# Altium project PCB_Luciernagas.PrjPcb
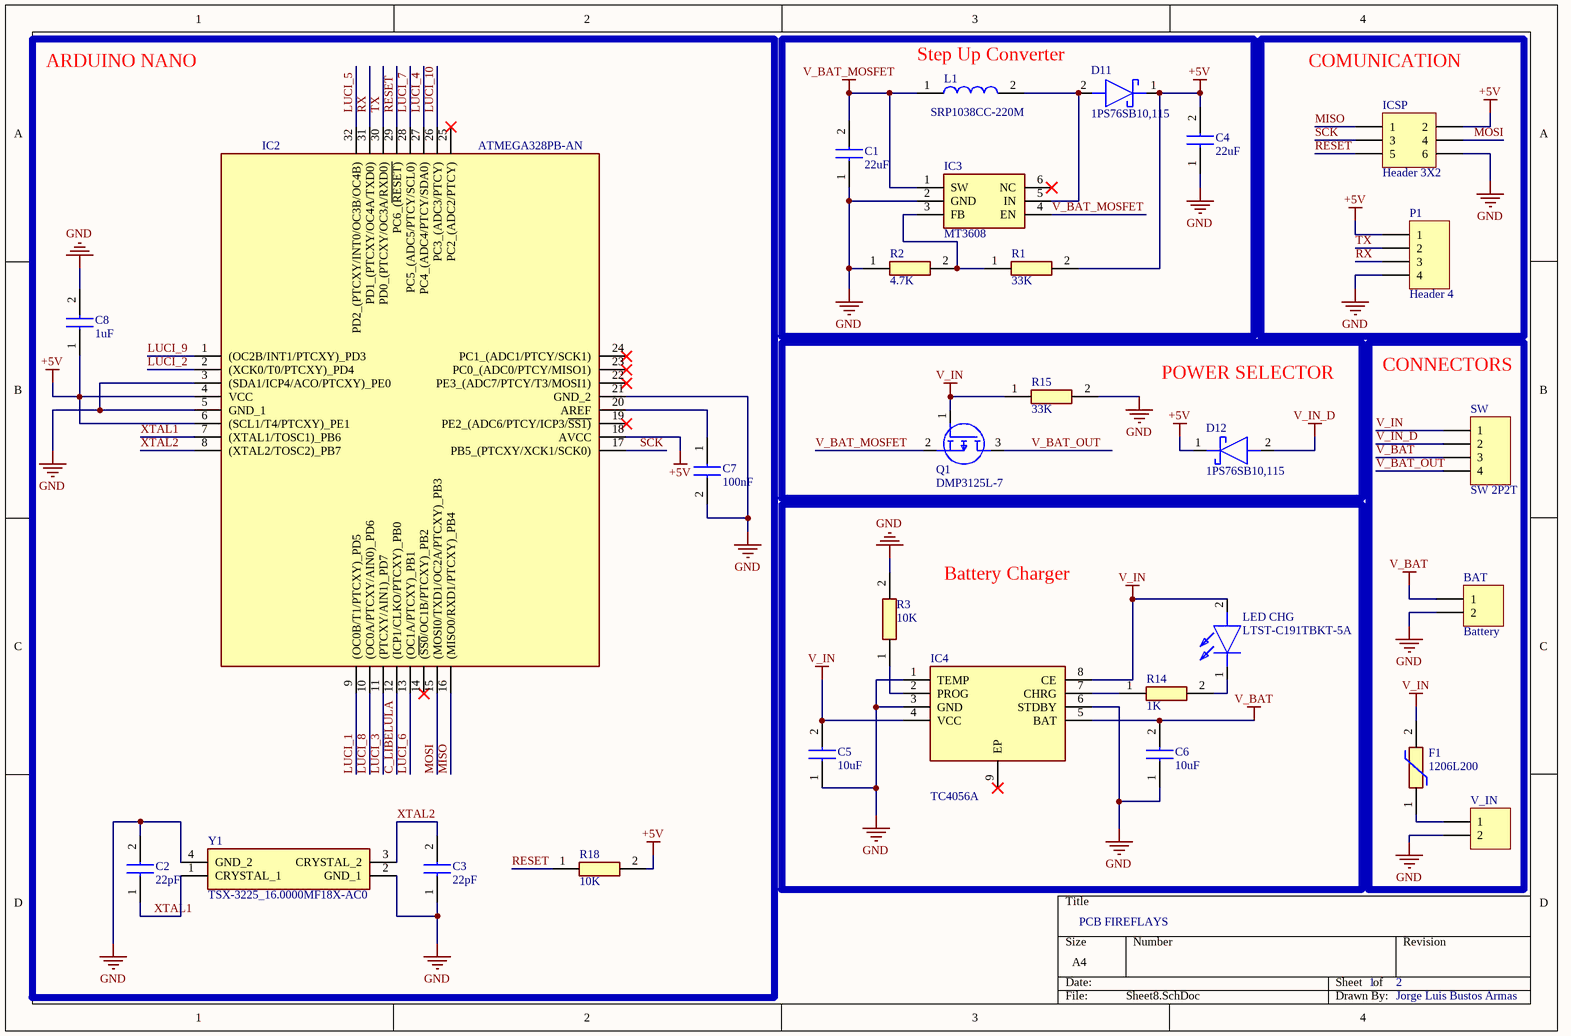
[diagram p0: Sheet8.SchDoc]
2 sheets, 56 parts. Net scope: global (net labels, ports and power ports of the same name join across sheets).
Board file: PCB_Tapa.PcbDoc
Sheets:
  Sheet8.SchDoc
  Sheet7.SchDoc

## Sheet Sheet8.SchDoc
size A4

### Parts
BAT  Battery  [HDR1X2]
C1  22uF  [CAPC1608X90N]
C2  22pF  [CAPC1608X90N]
C3  22pF  [CAPC1608X90N]
C4  22uF  [CAPC1608X90N]
C5  10uF  [CAPC1608X90N]
C6  10uF  [CAPC1608X90N]
C7  100nF  [CAPC1608X90N]
C8  1uF  [CAPC1608X90N]
D11  1PS76SB10,115  [SOD2512X110N]
D12  1PS76SB10,115  [SOD2512X110N]
F1  1206L200  [1206L05015YR]
IC2  ATMEGA328PB-AN  [QFP80P900X900X120-32N]
IC3  MT3608  [SOT95P280X145-6N]
IC4  TC4056A  [SOIC127P600X175-9N]
ICSP  Header 3X2  [HDR2X3]  (no BOM)
L1  SRP1038CC-220M  [INDPM110100X400N]
LED_CHG  LTST-C191TBKT-5A  [LEDC1608X60N]
P1  Header 4  [HDR1X4]  (no BOM)
Q1  DMP3125L-7  [SOT96P240X110-3N]
R1  33K  [RESC1608X55N]
R2  4.7K  [RESC1608X55N]
R3  10K  [RESC1608X55N]
R14  1K  [RESC1608X55N]
R15  33K  [RESC1608X55N]
R18  10K  [RESC1608X55N]
SW  SW 2P2T  [HDR1X4]
V_IN  Type C female connector  [HDR1X2]  (value not drawn)
Y1  TSX-3225_16.0000MF18X-AC0  [TSX3225160000MF18XAC0]

### Blocks framed on the sheet
ARDUINO NANO: C2 C3 C7 C8 IC2 R18 Y1
Step Up Converter: C1 C4 D11 IC3 L1 R1 R2
COMUNICATION: ICSP P1
POWER SELECTOR: D12 Q1 R15
CONNECTORS: BAT F1 SW V_IN
Battery Charger: C5 C6 IC4 LED_CHG R3 R14

### Nets
+5V: C4.2 C8.1 D11.1(K) D12.1(K) IC2.4(VCC) IC2.6((SCL1/T4/PTCXY)_PE1) IC2.18(AVCC) ICSP.2 P1.1 R1.2 R18.2
GND: BAT.2 C1.1 C2.2 C3.1 C4.1 C5.1 C6.1 C7.2 C8.2 IC2.3((SDA1/ICP4/ACO/PTCXY)_PE0) IC2.5(GND_1) IC2.21(GND_2) IC3.2(GND) IC4.1(TEMP) IC4.3(GND) IC4.6(STDBY) ICSP.6 P1.4 R2.1 R3.2 R15.2 V_IN.2 Y1.2(GND_1) Y1.4(GND_2)
V_BAT: BAT.1 C6.2 IC4.5(BAT) SW.3
V_BAT_MOSFET: C1.2 IC3.1(SW) IC3.4(EN) L1.1 Q1.2(S)
V_IN: C5.2 F1.2 IC4.4(VCC) IC4.8(CE) LED_CHG.2(A) Q1.1(G) R15.1 SW.1
V_IN_D: D12.2(A) SW.2
C_LIBELULA: IC2.12((ICP1/CLKO/PTCXY)_PB0)
LUCI_1: IC2.9((OC0B/T1/PTCXY)_PD5)
LUCI_2: IC2.2((XCK0/T0/PTCXY)_PD4)
LUCI_3: IC2.11((PTCXY/AIN1)_PD7)
LUCI_4: IC2.27(PC4_(ADC4/PTCY/SDA0))
LUCI_5: IC2.32(PD2_(PTCXY/INT0/OC3B/OC4B))
LUCI_6: IC2.13((OC1A/PTCXY)_PB1)
LUCI_7: IC2.28(PC5_(ADC5/PTCY/SCL0))
LUCI_8: IC2.10((OC0A/PTCXY/AIN0)_PD6)
LUCI_9: IC2.1((OC2B/INT1/PTCXY)_PD3)
LUCI_10: IC2.26(PC3_(ADC3/PTCY))
MISO: IC2.16((MISO0/RXD1/PTCXY)_PB4) ICSP.1
MOSI: IC2.15((MOSI0/TXD1/OC2A/PTCXY)_PB3) ICSP.4
RESET: IC2.29(PC6_(~{RESET)}) ICSP.5 R18.1
RX: IC2.31(PD1_(PTCXY/OC4A/TXD0)) P1.3
SCK: IC2.17(PB5_(PTCXY/XCK1/SCK0)) ICSP.3
TX: IC2.30(PD0_(PTCXY/OC3A/RXD0)) P1.2
V_BAT_OUT: Q1.3(D) SW.4
XTAL1: C2.1 IC2.7((XTAL1/TOSC1)_PB6) Y1.1(CRYSTAL_1)
XTAL2: C3.2 IC2.8((XTAL2/TOSC2)_PB7) Y1.3(CRYSTAL_2)
NetC7_1: C7.1 IC2.20(AREF)
NetD11_2: D11.2(A) IC3.5(IN) L1.2
NetF1_1: F1.1 V_IN.1
NetIC3_3: IC3.3(FB) R1.1 R2.2
NetIC4_2: IC4.2(PROG) R3.1
NetIC4_7: IC4.7(CHRG) R14.1
NetLED_CHG_1: LED_CHG.1(K) R14.2

Not connected (* = marked no-connect by the designer): IC2 14((~{SS0}/OC1B/PTCXY)_PB2)* 19(PE2_(ADC6/PTCY/ICP3/~{SS1)})* 22(PE3_(ADC7/PTCY/T3/MOSI1))* 23(PC0_(ADC0/PTCY/MISO1))* 24(PC1_(ADC1/PTCY/SCK1))* 25(PC2_(ADC2/PTCY))*; IC3 6(NC)*; IC4 9(EP)*

### Notes on the sheet
- PCB FIREFLAYS
- 1
- 2
- Jorge Luis Bustos Armas

### Library data of the parts
BAT = Header 2: Li-Po battery 400 mAh; LatestRevisionDate: 17-Jul-2002; LatestRevisionNote: Re-released for DXP Platform.; Publisher: Altium Limited
C1-C8 = 06035C105KAT2A: Capacitor; Manufacturer_Name: Kyocera AVX; Datasheet Link: https://componentsearchengine.com/Datasheets/1/06031A100FAT2A.pdf; Height: 0.9mm; Manufacturer_Part_Number: 06035C105KAT2A; Mouser Part Number: 581-06035C105KAT2A; Mouser Price/Stock: https://www.mouser.co.uk/ProductDetail/KYOCERA-AVX/06035C105KAT2A?qs=%252BdQmOuGyFcGCdIIWh6fU7Q%3D%3D; Arrow Part Number: 06035C105KAT2A; Arrow Price/Stock: https://www.arrow.com/en/products/06035c105kat2a/avx?region=nac
D11 D12 = 1PS76SB10,115: Schottky Diode; Manufacturer_Name: Nexperia; Datasheet Link: https://assets.nexperia.com/documents/data-sheet/1PS76SB10.pdf; Height: 1.1mm; Manufacturer_Part_Number: 1PS76SB10,115; Mouser Part Number: 771-1PS76SB10-T/R; Mouser Price/Stock: https://www.mouser.co.uk/ProductDetail/Nexperia/1PS76SB10115?qs=P62ublwmbi%252BteaMAe9dhAQ%3D%3D; Arrow Part Number: 1PS76SB10,115; Arrow Price/Stock: https://www.arrow.com/en/products/1ps76sb10115/nexperia?region=europe
F1 = 1206L200: Resettable Fuse; Manufacturer_Name: LITTELFUSE; Datasheet Link: https://m.littelfuse.com/~/media/electronics/datasheets/resettable_ptcs/littelfuse_ptc_1206l_datasheet.pdf.pdf; Height: 0.75mm; Manufacturer_Part_Number: 1206L200
IC2 = ATMEGA328PB-AN: Integrated Circuit; Manufacturer_Name: Microchip; Datasheet Link: http://ww1.microchip.com/downloads/en/DeviceDoc/40001906C.pdf; Height: 1.2mm; Manufacturer_Part_Number: ATMEGA328PB-AN; Mouser Part Number: 556-ATMEGA328PB-AN; Mouser Price/Stock: https://www.mouser.co.uk/ProductDetail/Microchip-Technology/ATMEGA328PB-AN?qs=jy4bLUHv09gDoS2J01KCIw%3D%3D; Arrow Part Number: ATMEGA328PB-AN; Arrow Price/Stock: https://www.arrow.com/en/products/atmega328pb-an/microchip-technology?region=nac
IC3 = MT3608: Integrated Circuit; Manufacturer_Name: Aerosemi; Datasheet Link: https://www.olimex.com/Products/Breadboarding/BB-PWR-3608/resources/MT3608.pdf; Height: 1.45mm; Manufacturer_Part_Number: MT3608
IC4 = TC4056A: Integrated Circuit; Manufacturer_Name: Shenzhen Fuman Elec; Height: 1.75mm; Manufacturer_Part_Number: TC4056A
ICSP = Header 3X2: Header, 3-Pin, Dual row; LatestRevisionDate: 17-Jul-2002; LatestRevisionNote: Re-released for DXP Platform.; Publisher: Altium Limited
L1 = SRP1038CC-220M: Inductor; Manufacturer_Name: Bourns; Datasheet Link: https://www.bourns.com/docs/Product-Datasheets/SRP1038CC.pdf; Height: 4mm; Manufacturer_Part_Number: SRP1038CC-220M; Mouser Part Number: 652-SRP1038CC-220M; Mouser Price/Stock: https://www.mouser.co.uk/ProductDetail/Bourns/SRP1038CC-220M?qs=1Kr7Jg1SGW9WsxR9tq21fg%3D%3D; Arrow Part Number: SRP1038CC-220M; Arrow Price/Stock: https://www.arrow.com/en/products/srp1038cc-220m/bourns?region=nac
LED_CHG = LTST-C191TBKT-5A: LED; Manufacturer_Name: Lite-On; Datasheet Link: http://www.mouser.com/ds/2/239/S_110_LTST-C191TBKT-5A-336399.pdf; Height: 0.65mm; Manufacturer_Part_Number: LTST-C191TBKT-5A; Mouser Part Number: 859-LTST-C191TBKT-5A; Mouser Price/Stock: https://www.mouser.co.uk/ProductDetail/Lite-On/LTST-C191TBKT-5A?qs=xb8aMrBSZRLgwF8AXHEbeQ%3D%3D; Arrow Part Number: LTST-C191TBKT-5A; Arrow Price/Stock: https://www.arrow.com/en/products/ltst-c191tbkt-5a/lite-on-technology?region=europe
P1 = Header 4: Header, 4-Pin; LatestRevisionDate: 17-Jul-2002; LatestRevisionNote: Re-released for DXP Platform.; Publisher: Altium Limited
Q1 = DMP3125L-7: MOSFET (P-Channel); Manufacturer_Name: Diodes Incorporated; Datasheet Link: https://www.diodes.com//assets/Datasheets/DMP3125L.pdf; Height: 1.1mm; Manufacturer_Part_Number: DMP3125L-7; Mouser Part Number: 621-DMP3125L-7; Mouser Price/Stock: https://www.mouser.co.uk/ProductDetail/Diodes-Incorporated/DMP3125L-7?qs=W0yvOO0ixfH8ma8MdHfXQA%3D%3D; Arrow Part Number: DMP3125L-7; Arrow Price/Stock: https://www.arrow.com/en/products/dmp3125l-7/diodes-incorporated?region=nac
R1-R3 R14 R15 R18 = KTR03EZPF1501: Resistor; Manufacturer_Name: ROHM Semiconductor; Datasheet Link: http://rohmfs.rohm.com/en/products/databook/datasheet/passive/resistor/chip_resistor/ktr.pdf; Height: 0.55mm; Manufacturer_Part_Number: KTR03EZPF1501; Mouser Part Number: 755-KTR03EZPF1501; Mouser Price/Stock: https://www.mouser.com/Search/Refine.aspx?Keyword=755-KTR03EZPF1501
SW = Header 4: SWITCH, 2 POLES 2 THROWS; LatestRevisionDate: 17-Jul-2002; LatestRevisionNote: Re-released for DXP Platform.; Publisher: Altium Limited
V_IN = Header 2: USB Type C 2 Pins Connector Jack Female Type-C 3A 30V Oval with Wire Current Fast Charging Jacker Port USB-C Charger Plug Socket; LatestRevisionDate: 17-Jul-2002; LatestRevisionNote: Re-released for DXP Platform.; Publisher: Altium Limited; Supplier: https://www.aliexpress.com/item/1005006809102590.html?gatewayAdapt=glo2esp
Y1 = TSX-3225_16.0000MF18X-AC0: Crystal or Oscillator; Manufacturer_Name: Epson Timing; Manufacturer_Part_Number: TSX-3225 16.0000MF18X-AC0; Datasheet Link: https://support.epson.biz/td/api/doc_check.php?dl=brief_FA-238V_en.pdf; Height: 0.6mm; Mouser Part Number: 732-322516F18XAC0; Mouser Price/Stock: https://www.mouser.co.uk/ProductDetail/Epson-Timing/TSX-3225-16.0000MF18X-AC0?qs=wwacUt%252BV97taurHtFwy%2FEA%3D%3D; Arrow Part Number: TSX-3225 16.0000MF18X-AC0; Arrow Price/Stock: https://www.arrow.com/en/products/tsx-322516.0000mf18x-ac0/epson-electronics-america?region=nac

## Sheet Sheet7.SchDoc
size A4
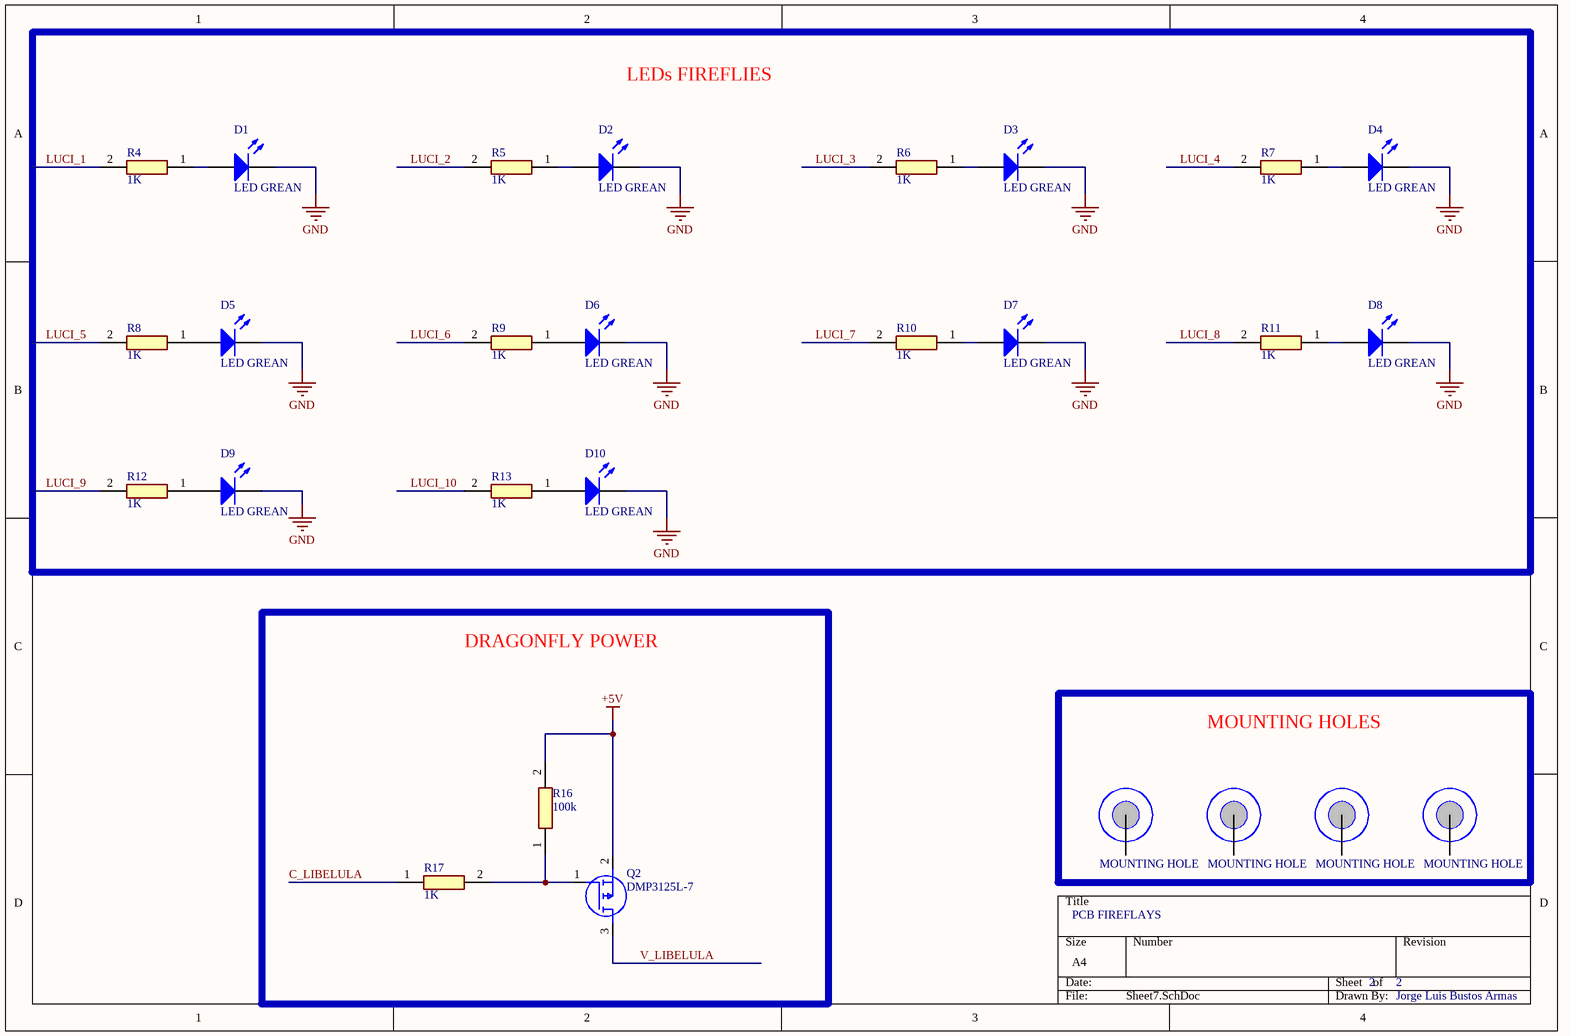
[diagram p1: Sheet7.SchDoc]

### Parts
D1  LED GREAN  [LED 5mm]
D2  LED GREAN  [LED 5mm]
D3  LED GREAN  [LED 5mm]
D4  LED GREAN  [LED 5mm]
D5  LED GREAN  [LED 5mm]
D6  LED GREAN  [LED 5mm]
D7  LED GREAN  [LED 5mm]
D8  LED GREAN  [LED 5mm]
D9  LED GREAN  [LED 5mm]
D10  LED GREAN  [LED 5mm]
MH1  MOUNTING HOLE  [MH]  (no BOM)
MH2  MOUNTING HOLE  [MH]  (no BOM)
MH3  MOUNTING HOLE  [MH]  (no BOM)
MH4  MOUNTING HOLE  [MH]  (no BOM)
Q2  DMP3125L-7  [SOT96P240X110-3N]
R4  1K  [RESC1608X55N]
R5  1K  [RESC1608X55N]
R6  1K  [RESC1608X55N]
R7  1K  [RESC1608X55N]
R8  1K  [RESC1608X55N]
R9  1K  [RESC1608X55N]
R10  1K  [RESC1608X55N]
R11  1K  [RESC1608X55N]
R12  1K  [RESC1608X55N]
R13  1K  [RESC1608X55N]
R16  100k  [RESC1608X55N]
R17  1K  [RESC1608X55N]

### Blocks framed on the sheet
LEDs FIREFLIES: D1-D10 R4-R13
DRAGONFLY POWER: Q2 R16 R17
MOUNTING HOLES: MH1-MH4

### Nets
+5V: Q2.2(S) R16.2
GND: D1.2(K) D2.2(K) D3.2(K) D4.2(K) D5.2(K) D6.2(K) D7.2(K) D8.2(K) D9.2(K) D10.2(K)
C_LIBELULA: R17.1
LUCI_1: R4.2
LUCI_2: R5.2
LUCI_3: R6.2
LUCI_4: R7.2
LUCI_5: R8.2
LUCI_6: R9.2
LUCI_7: R10.2
LUCI_8: R11.2
LUCI_9: R12.2
LUCI_10: R13.2
V_LIBELULA: Q2.3(D)
NetD1_1: D1.1(A) R4.1
NetD2_1: D2.1(A) R5.1
NetD3_1: D3.1(A) R6.1
NetD4_1: D4.1(A) R7.1
NetD5_1: D5.1(A) R8.1
NetD6_1: D6.1(A) R9.1
NetD7_1: D7.1(A) R10.1
NetD8_1: D8.1(A) R11.1
NetD9_1: D9.1(A) R12.1
NetD10_1: D10.1(A) R13.1
NetQ2_1: Q2.1(G) R16.1 R17.2

Not connected (* = marked no-connect by the designer): MH1 ?1; MH2 ?1; MH3 ?1; MH4 ?1

### Notes on the sheet
- PCB FIREFLAYS
- 2
- Jorge Luis Bustos Armas

### Library data of the parts
D1-D10 = LED1: Typical GREAN LED; Published: 8-Jun-2000; LatestRevisionDate: 08-Jul-2005; LatestRevisionNote: Mech Layer 1 removed.; PackageReference: LED-1; Publisher: Altium Limited; PackageDescription: LED; 2 Leads
Q2 = DMP3125L-7: as Q1 on sheet Sheet8; Datasheet Link: https://www.diodes.com//assets/Datasheets/DMP3125L.pdf; Height: 1.1mm; Manufacturer_Part_Number: DMP3125L-7; Mouser Part Number: 621-DMP3125L-7; Mouser Price/Stock: https://www.mouser.co.uk/ProductDetail/Diodes-Incorporated/DMP3125L-7?qs=W0yvOO0ixfH8ma8MdHfXQA%3D%3D; Arrow Part Number: DMP3125L-7; Arrow Price/Stock: https://www.arrow.com/en/products/dmp3125l-7/diodes-incorporated?region=nac
R4-R13 R16 R17 = KTR03EZPF1501: as R1 on sheet Sheet8; Datasheet Link: http://rohmfs.rohm.com/en/products/databook/datasheet/passive/resistor/chip_resistor/ktr.pdf; Height: 0.55mm; Manufacturer_Part_Number: KTR03EZPF1501; Mouser Part Number: 755-KTR03EZPF1501; Mouser Price/Stock: https://www.mouser.com/Search/Refine.aspx?Keyword=755-KTR03EZPF1501

## Nets that join several sheets
+5V: Sheet8 (11 pins), Sheet7 (Q2.2 R16.2)
GND: Sheet8 (24 pins), Sheet7 (10 pins)
C_LIBELULA: Sheet8 (IC2.12), Sheet7 (R17.1)
LUCI_1: Sheet8 (IC2.9), Sheet7 (R4.2)
LUCI_2: Sheet8 (IC2.2), Sheet7 (R5.2)
LUCI_3: Sheet8 (IC2.11), Sheet7 (R6.2)
LUCI_4: Sheet8 (IC2.27), Sheet7 (R7.2)
LUCI_5: Sheet8 (IC2.32), Sheet7 (R8.2)
LUCI_6: Sheet8 (IC2.13), Sheet7 (R9.2)
LUCI_7: Sheet8 (IC2.28), Sheet7 (R10.2)
LUCI_8: Sheet8 (IC2.10), Sheet7 (R11.2)
LUCI_9: Sheet8 (IC2.1), Sheet7 (R12.2)
LUCI_10: Sheet8 (IC2.26), Sheet7 (R13.2)